# Altium schematic sheet main_pinout.SchDoc
size A
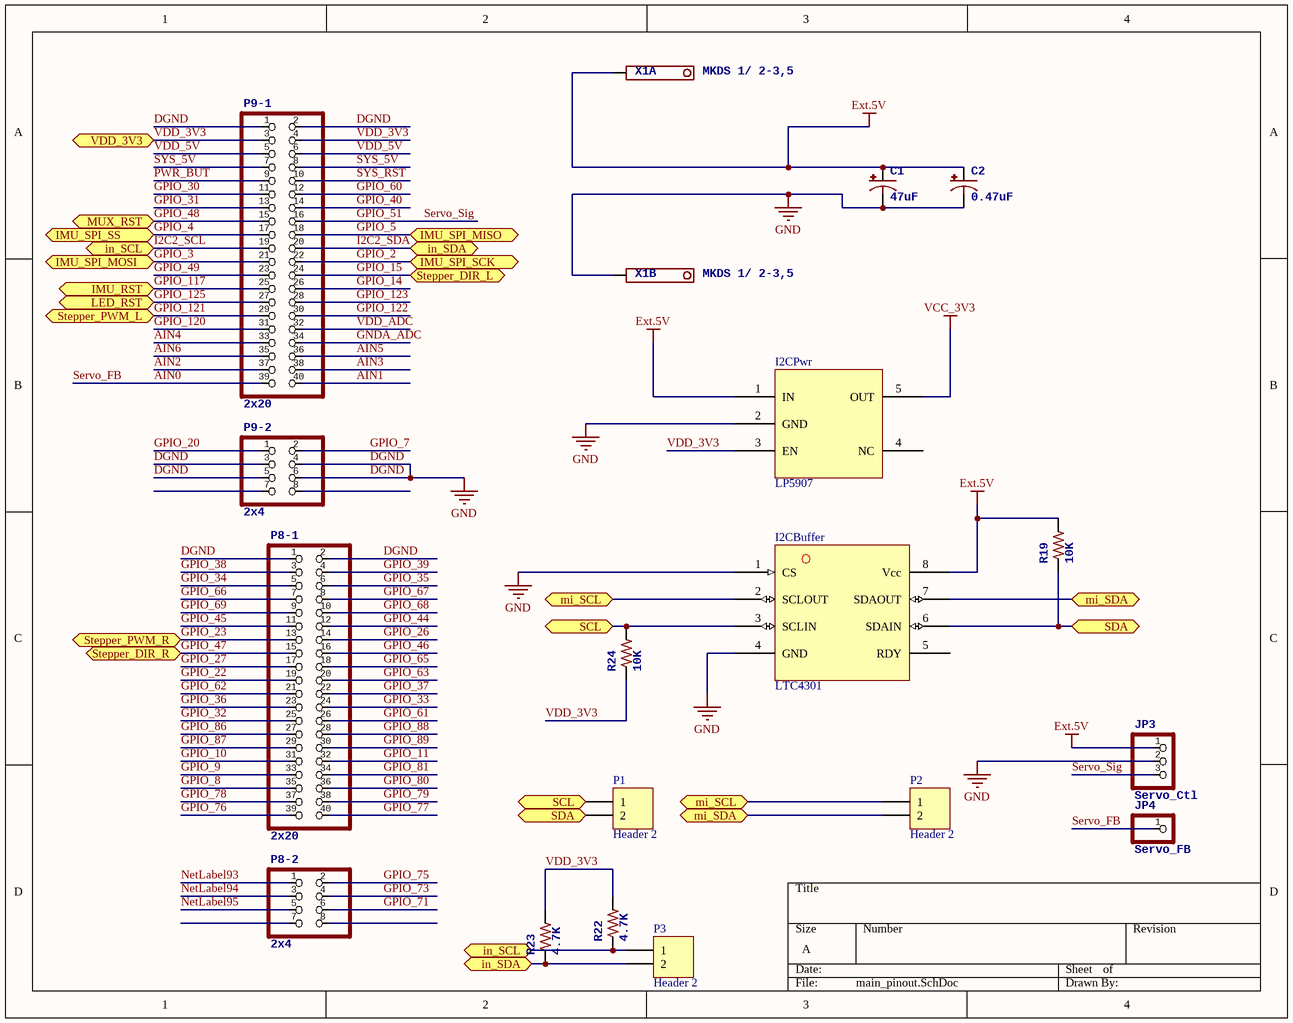
[diagram p0: main_pinout.SchDoc]

## Parts
C1  47uF  [E2,5-7]
C2  0.47uF  [E5-6]
I2CBuffer  LTC4301  [TSSOP-8]
I2CPwr  LP5907  [SOT23-5L]
JP3  Servo_Ctl  [1X03]
JP4  Servo_FB  [1X01]
P1  Header 2  [HDR1X2]
P2  Header 2  [HDR1X2]
P3  Header 2  [HDR1X2]
P8-1  2x20  [2X20]
P8-2  2x4  [2X04]
P9-1  2x20  [2X20]
P9-2  2x4  [2X04]
R19  10K  [R0805]
R22  4.7K  [R0805]
R23  4.7K  [R0805]
R24  10K  [R0805]
X1  MKDS 1/ 2-3,5  [1751248]  (parts A,B of 2)

## Ports
IMU_RST, IMU_SPI_MISO, IMU_SPI_MOSI, IMU_SPI_SCK, IMU_SPI_SS, in_SCL, in_SDA, LED_RST, mi_SCL, mi_SDA, MUX_RST, SCL, SDA, Stepper_DIR_L, Stepper_DIR_R, Stepper_PWM_L, Stepper_PWM_R, VDD_3V3

## Nets
DGND: C1.- C2.- I2CBuffer.1(CS) I2CBuffer.4(GND) I2CPwr.2(GND) JP3.2 P8-1.1 P8-1.2 P9-1.1 P9-1.2 P9-2.3 P9-2.4 P9-2.5 P9-2.6 X1.2(K)  [also labelled GND]
Ext.5V: C1.+ C2.+ I2CBuffer.8(Vcc) I2CPwr.1(IN) JP3.1 R19.2 X1.1(K)
VCC_3V3: I2CPwr.5(OUT)
AIN0: JP4.1 P9-1.39  [also labelled Servo_FB]
AIN1: P9-1.40
AIN2: P9-1.37
AIN3: P9-1.38
AIN4: P9-1.33
AIN5: P9-1.36
AIN6: P9-1.35
GNDA_ADC: P9-1.34
GPIO_2: P9-1.22 ; port IMU_SPI_SCK
GPIO_3: P9-1.21 ; port IMU_SPI_MOSI
GPIO_4: P9-1.17 ; port IMU_SPI_SS
GPIO_5: P9-1.18 ; port IMU_SPI_MISO
GPIO_7: P9-2.2
GPIO_8: P8-1.35
GPIO_9: P8-1.33
GPIO_10: P8-1.31
GPIO_11: P8-1.32
GPIO_14: P9-1.26
GPIO_15: P9-1.24 ; port Stepper_DIR_L
GPIO_20: P9-2.1
GPIO_22: P8-1.19
GPIO_23: P8-1.13 ; port Stepper_PWM_R
GPIO_26: P8-1.14
GPIO_27: P8-1.17
GPIO_30: P9-1.11
GPIO_31: P9-1.13
GPIO_32: P8-1.25
GPIO_33: P8-1.24
GPIO_34: P8-1.5
GPIO_35: P8-1.6
GPIO_36: P8-1.23
GPIO_37: P8-1.22
GPIO_38: P8-1.3
GPIO_39: P8-1.4
GPIO_40: P9-1.14
GPIO_44: P8-1.12
GPIO_45: P8-1.11
GPIO_46: P8-1.16
GPIO_47: P8-1.15 ; port Stepper_DIR_R
GPIO_48: P9-1.15 ; port MUX_RST
GPIO_49: P9-1.23
GPIO_51: JP3.3 P9-1.16  [also labelled Servo_Sig]
GPIO_60: P9-1.12
GPIO_61: P8-1.26
GPIO_62: P8-1.21
GPIO_63: P8-1.20
GPIO_65: P8-1.18
GPIO_66: P8-1.7
GPIO_67: P8-1.8
GPIO_68: P8-1.10
GPIO_69: P8-1.9
GPIO_71: P8-2.6
GPIO_73: P8-2.4
GPIO_75: P8-2.2
GPIO_76: P8-1.39
GPIO_77: P8-1.40
GPIO_78: P8-1.37
GPIO_79: P8-1.38
GPIO_80: P8-1.36
GPIO_81: P8-1.34
GPIO_86: P8-1.27
GPIO_87: P8-1.29
GPIO_88: P8-1.28
GPIO_89: P8-1.30
GPIO_117: P9-1.25 ; port IMU_RST
GPIO_120: P9-1.31
GPIO_121: P9-1.29 ; port Stepper_PWM_L
GPIO_122: P9-1.30
GPIO_123: P9-1.28
GPIO_125: P9-1.27 ; port LED_RST
I2C2_SCL: P3.1 P9-1.19 R22.1 ; port in_SCL
I2C2_SDA: P3.2 P9-1.20 R23.1 ; port in_SDA
mi_SCL: I2CBuffer.2(SCLOUT) P2.1 ; port mi_SCL
mi_SDA: I2CBuffer.7(SDAOUT) P2.2 ; port mi_SDA
NetLabel93: P8-2.1
NetLabel94: P8-2.3
NetLabel95: P8-2.5
PWR_BUT: P9-1.9
SCL: I2CBuffer.3(SCLIN) P1.1 R24.2 ; port SCL
SDA: I2CBuffer.6(SDAIN) P1.2 R19.1 ; port SDA
SYS_5V: P9-1.7 P9-1.8
SYS_RST: P9-1.10
VDD_3V3: I2CPwr.3(EN) P9-1.3 P9-1.4 R22.2 R23.2 R24.1 ; port VDD_3V3
VDD_5V: P9-1.5 P9-1.6
VDD_ADC: P9-1.32

Not connected (* = marked no-connect by the designer): I2CBuffer 5(RDY); I2CPwr 4(NC); P8-2 7 8; P9-2 7 8

## Library data of the parts
C1 = CPOL-USE2.5-7
C2 = CPOL-USE5-6
JP3 = PINHD-1X3
JP4 = PINHD-1X1
P1-P3 = Header 2: Header, 2-Pin; LatestRevisionDate: 17-Jul-2002; LatestRevisionNote: Re-released for DXP Platform.; Publisher: Altium Limited
P8-1 P9-1 = PINHD-2X20
P8-2 P9-2 = PINHD-2X4
R19 R22-R24 = R-US_R0805
X1 = 1751248: OC_FARNELL: unknown; OC_NEWARK: unknown